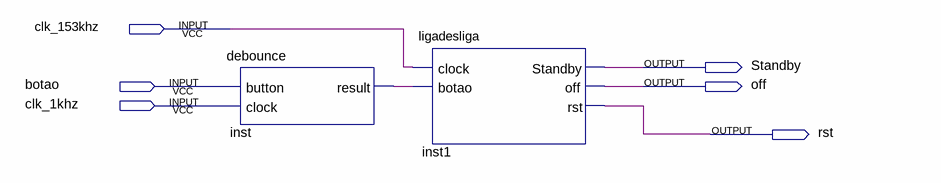
[diagram p0: schematic sheet]
// Quartus schematic historia4.bdf as structural Verilog: 2 symbols, 6 pins
module historia4 (
  input  clk_153khz,
  input  botao,
  input  clk_1khz,
  output Standby,
  output off,
  output rst
);

  wire inst_result;

  debounce inst (.button(botao), .clock(clk_1khz), .result(inst_result));
  ligadesliga inst1 (.clock(clk_153khz), .botao(inst_result), .Standby(Standby), .off(off), .rst(rst));
endmodule
